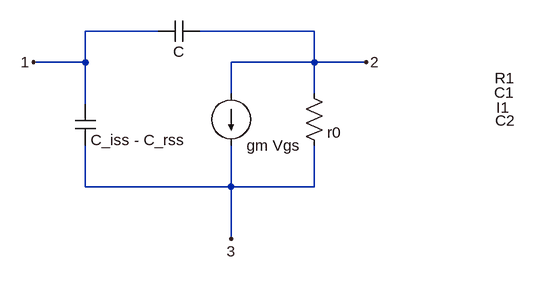
[diagram p0: schematic BS170.asc]
BS170.asc, the LTspice schematic file:
Version 4.1
SHEET 1 880 680
WIRE 208 112 96 112
WIRE 448 112 272 112
WIRE 96 160 96 112
WIRE 96 160 16 160
WIRE 448 160 448 112
WIRE 448 160 320 160
WIRE 528 160 448 160
WIRE 320 208 320 160
WIRE 448 208 448 160
WIRE 96 224 96 160
WIRE 96 352 96 288
WIRE 320 352 320 288
WIRE 320 352 96 352
WIRE 448 352 448 288
WIRE 448 352 320 352
WIRE 320 432 320 352
FLAG 16 160 1
FLAG 528 160 2
FLAG 320 432 3
SYMBOL cap 80 224 R0
WINDOW 0 645 -17 Left 2
SYMATTR InstName C1
SYMATTR Value C_iss - C_rss
SYMBOL cap 272 96 R90
WINDOW 0 169 -470 VBottom 2
WINDOW 3 32 32 VTop 2
SYMATTR InstName C2
SYMBOL res 432 192 R0
WINDOW 0 294 -8 Left 2
SYMATTR InstName R1
SYMATTR Value r0
SYMBOL current 320 208 R0
WINDOW 0 408 22 Left 2
SYMATTR InstName I1
SYMATTR Value gm Vgs

The netlist it stands for:
* BS170.asc
C1 1 3 C_iss - C_rss
C2 2 1 C
R1 2 3 r0
I1 2 3 gm Vgs
.backanno
.end